# Altium schematic sheet AUDIO.SchDoc: AUDIO
size A4; Date: Not used; ApprovedBy: Not used; CheckedBy: Not used; Author: Not used; CompanyName: STMicroelectronics; DrawnBy: Not used; Engineer: Not used; Organization: Not used; Address1: Not used; Address2: Not used; Address3: Not used; Address4: Not used; DocumentNumber: Not used; Revision: Not used; SheetNumber: 11; SheetTotal: 16; CurrentTime: Not used; CurrentDate: Not used; Time: Not used; DocumentFullPathAndName: Not used; DocumentName: Not used; ModifiedDate: Not used; ImagePath: Not used; ProjectName: Not used; Application_BuildNumber: Not used
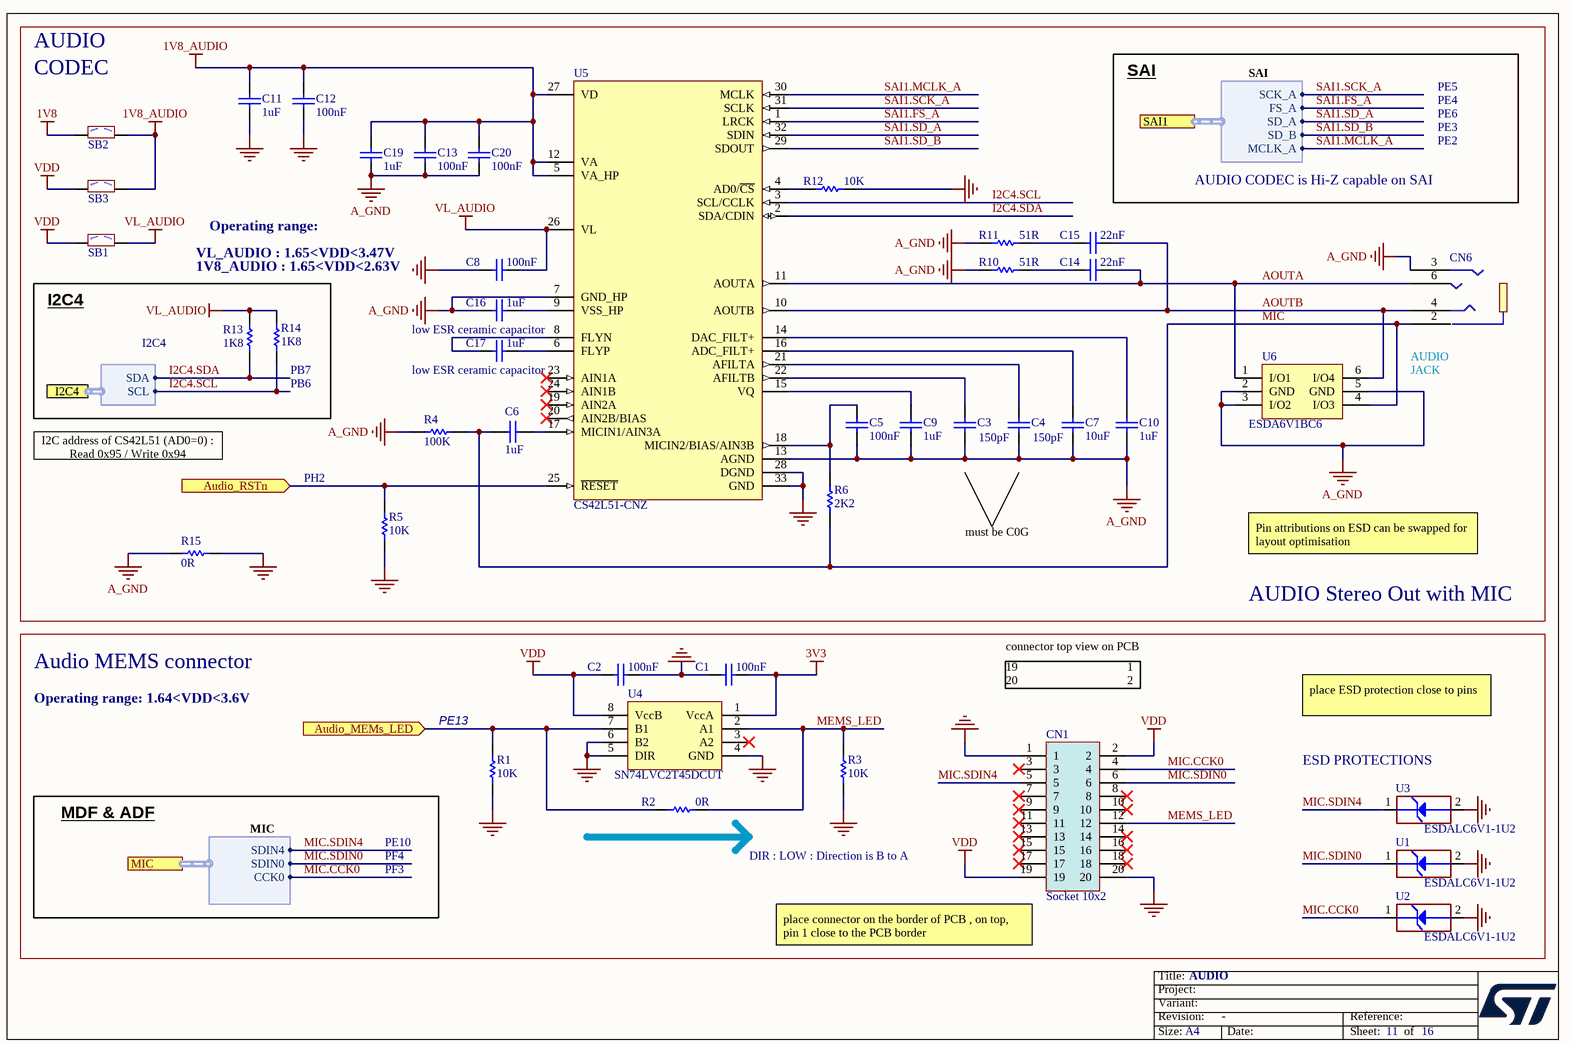
[diagram p0: AUDIO.SchDoc]

## Parts
C1  value 100nF  [C0402]  (hidden comment: Capacitor)
C2  value 100nF  [C0402]  (hidden comment: Capacitor)
C3  value 150pF  [C0603]  (hidden comment: Capacitor)
C4  value 150pF  [C0603]  (hidden comment: Capacitor)
C5  value 100nF  [C0402]  (hidden comment: Capacitor)
C6  value 1uF  [C0402]  (hidden comment: Capacitor)
C7  value 10uF  [C0603]  (hidden comment: Capacitor)
C8  value 100nF  [C0402]  (hidden comment: Capacitor)
C9  value 1uF  [C0402]  (hidden comment: Capacitor)
C10  value 1uF  [C0402]  (hidden comment: Capacitor)
C11  value 1uF  [C0402]  (hidden comment: Capacitor)
C12  value 100nF  [C0402]  (hidden comment: Capacitor)
C13  value 100nF  [C0402]  (hidden comment: Capacitor)
C14  value 22nF  [C0402]  (hidden comment: Capacitor)
C15  value 22nF  [C0402]  (hidden comment: Capacitor)
C16  value 1uF  [C0603]  (hidden comment: Capacitor)
C17  value 1uF  [C0603]  (hidden comment: Capacitor)
C19  value 1uF  [C0402]  (hidden comment: Capacitor)
C20  value 100nF  [C0402]  (hidden comment: Capacitor)
CN1  Socket 10x2  [CON_FCI_20021311-XXX20XXLF]
CN6  Jack_PJ3028B-3_4P  [CON_PHONE-JACK-3P5_HY_PJ3028B]  (value not drawn)
R1  value 10K  [R0402]  (hidden comment: Resistor)
R2  value 0R  [R0402]  (hidden comment: Resistor)
R3  value 10K  [R0402]  (hidden comment: Resistor)
R4  value 100K  [R0402]  (hidden comment: Resistor)
R5  value 10K  [R0402]  (hidden comment: Resistor)
R6  value 2K2  [R0402]  (hidden comment: Resistor)
R10  value 51R  [R0402]  (hidden comment: Resistor)
R11  value 51R  [R0402]  (hidden comment: Resistor)
R12  value 10K  [R0402]  (hidden comment: Resistor)
R13  value 1K8  [R0402]  (hidden comment: Resistor)
R14  value 1K8  [R0402]  (hidden comment: Resistor)
R15  value 0R  [R0402]  (hidden comment: Resistor)
SB1  SB_OFF  [SOLDER-BRIDGE_R0402-0R]  (value not drawn)
SB2  SB_OFF  [SOLDER-BRIDGE_R0402-0R]  (value not drawn)
SB3  SB_OFF  [SOLDER-BRIDGE_R0402-0R]  (value not drawn)
U1  value ESDALC6V1-1U2  [ESD_ST0201]  (hidden comment: ESD-TRANSIL)
U2  value ESDALC6V1-1U2  [ESD_ST0201]  (hidden comment: ESD-TRANSIL)
U3  value ESDALC6V1-1U2  [ESD_ST0201]  (hidden comment: ESD-TRANSIL)
U4  SN74LVC2T45DCUT  [ICC_VSSOP8_DCU_R-PDSO-G8_2X2P30_P050]
U5  CS42L51-CNZ  [ICC_QFN32-EPAD_5X5_P050]
U6  ESDA6V1BC6  [ESD_SOT23-6L]

## Blocks framed on the sheet
I2C4: R13 R14
Audio MEMS connector: C1 C2 CN1 R1-R3 U1-U4

## Ports
Audio_MEMs_LED (in), Audio_RSTn (in), I2C4 (harness I2C4), MIC (harness MIC), SAI1 (harness SAI)

## Harnesses
I2C4: SDA, SCL
MIC: SDIN0, CCK0, SDIN4
SAI: SD_B, FS_A, SD_A, SCK_A, MCLK_A

## Nets
1V8: SB2.1
1V8_AUDIO: C11.2 C12.2 C13.2 C19.2 C20.2 SB2.2 SB3.2 U5.5(VA_HP) U5.12(VA) U5.27(VD)
3V3: C1.2 U4.1(VccA)
A_GND: C3.1 C4.1 C5.1 C7.1 C9.1 C10.1 C13.1 C16.1 C19.1 C20.1 CN6.3 R4.1 R10.1 R11.1 R15.1 U5.7(GND_HP) U5.13(AGND) U6.2(GND) U6.3(I/O2) U6.5(GND)
GND: C1.1 C2.2 C8.2 C11.1 C12.1 CN1.1 CN1.20 R1.1 R3.1 R5.1 R12.2 R15.2 U1.2(GND) U2.2(GND) U3.2(GND) U4.4(GND) U4.5(DIR) U4.6(B2) U5.28(DGND) U5.33(GND)
VDD: C2.1 CN1.2 CN1.19 SB1.1 SB3.1 U4.8(VccB)
VL_AUDIO: C8.1 R13.2 R14.2 SB1.2 U5.26(VL)
AOUTA: C14.2 CN6.6 U5.11(AOUTA) U6.1(I/O1)
AOUTB: C15.2 CN6.4 U5.10(AOUTB) U6.6(I/O4)
Audio_MEMs_LED: R1.2 R2.1 U4.7(B1) ; port Audio_MEMs_LED
Audio_RSTn: R5.2 U5.25(~{RESET}) ; port Audio_RSTn
I2C4.SCL: R14.1 U5.3(SCL/CCLK) ; port I2C4.SCL
I2C4.SDA: R13.1 U5.2(SDA/CDIN) ; port I2C4.SDA
MEMS_LED: CN1.12 R2.2 R3.2 U4.2(A1)
MIC: C6.1 CN6.2 R4.2 R6.1 U6.4(I/O3)
MIC.CCK0: CN1.4 U2.1(IO1) ; port MIC.CCK0
MIC.SDIN0: CN1.6 U1.1(IO1) ; port MIC.SDIN0
MIC.SDIN4: CN1.5 U3.1(IO1) ; port MIC.SDIN4
SAI1.FS_A: U5.1(LRCK) ; port SAI1.FS_A
SAI1.MCLK_A: U5.30(MCLK) ; port SAI1.MCLK_A
SAI1.SCK_A: U5.31(SCLK) ; port SAI1.SCK_A
SAI1.SD_A: U5.32(SDIN) ; port SAI1.SD_A
SAI1.SD_B: U5.29(SDOUT) ; port SAI1.SD_B
NetC3_2: C3.2 U5.22(AFILTB)
NetC4_2: C4.2 U5.21(AFILTA)
NetC5_2: C5.2 R6.2 U5.18(MICIN2/BIAS/AIN3B)
NetC6_2: C6.2 U5.17(MICIN1/AIN3A)
NetC7_2: C7.2 U5.16(ADC_FILT+)
NetC9_2: C9.2 U5.15(VQ)
NetC10_2: C10.2 U5.14(DAC_FILT+)
NetC14_1: C14.1 R10.2
NetC15_1: C15.1 R11.2
NetC16_2: C16.2 U5.9(VSS_HP)
NetC17_1: C17.1 U5.8(FLYN)
NetC17_2: C17.2 U5.6(FLYP)
NetR12_1: R12.1 U5.4(AD0/~{CS})

Not connected (* = marked no-connect by the designer): CN1 3* 7* 8* 9* 10* 11* 13* 14* 15* 16* 17* 18*; U4 3(A2)*; U5 19(AIN2A)* 20(AIN2B/BIAS)* 23(AIN1A)* 24(AIN1B)*

## Notes on the sheet
- AUDIO
- CODEC
- SAI
- PE4
- PE5
- PE6
- AUDIO CODEC is Hi-Z capable on SAI
- PE2
- PE3
- Operating range:
- (near C8) VL_AUDIO : 1.65<VDD<3.47V
- 1V8_AUDIO : 1.65<VDD<2.63V
- PB6
- (near R14) PB7
- low ESR ceramic capacitor
- (near CN6) AUDIO
- JACK
- I2C address of CS42L51 (AD0=0) :
  Read 0x95 / Write 0x94
- PH2
- must be C0G
- Pin attributions on ESD can be swapped for layout optimisation
- connector top view on PCB
- AUDIO Stereo Out with MIC
- Operating range: 1.64<VDD<3.6V
- (near R1) PE13
- 19
- 20
- 1
- 2
- place ESD protection close to pins
- (near U3) ESD PROTECTIONS
- MDF & ADF
- PF4
- PE10
- (near R2) DIR : LOW : Direction is B to A
- PF3
- (near CN1) place connector on the border of PCB , on top, pin 1 close to the PCB border
- Title:
- Project:
- Size:
- Revision:
- Variant:
- A4
- -
- Date:
- Reference:
- Sheet:
- of

## Library data of the parts
C1 C2 C5 C8 C12 C13 C20 = MCD-00006: Capacitor, MLCC, 100nF, 16V, X7R, +/-10%, 0402, T=0.5mm; Manufacturer_Part_Number: CC0402KRX7R7BB104; Manufacturer: YAGEO; Part_Preference: Recommended; Order_Code_RS: 616-9701; Component_Country_Of_Origin: China; Internal_Part_Number: MCD-00006; Status: Released; Part_Type: Capacitor; Package: 0402; ComponentLink1URL: http://tunmcdsvn.tun.st.com/Component_Documentation_Library/Trunk/Capacitor/YAGEO_X7R_Series; Order_Code_Digikey: 311-1338-1-ND; Order_Code_Farnell: 9402047
C3 C4 = MCD-00304: Capacitor, MLCC, 150pF, 50V, COG, +/-5%, 0603, T=0.8mm; Manufacturer_Part_Number: CC0603JRNPO9BN151; Manufacturer: YAGEO; BMS_Part_Number: 9142051; Part_Preference: Recommended; Component_Country_Of_Origin: China; Internal_Part_Number: MCD-00304; Status: Released; Part_Type: Capacitor; Package: 0603; ComponentLink1URL: http://tunmcdsvn.tun.st.com/Component_Documentation_Library/Trunk/Capacitor/YAGEO_NP0_Series; Order_Code_Digikey: 311-1071-1-ND; Order_Code_Farnell: 722108; Order_Code_RS: N/A
C6 C9-C11 C19 = MCD-01722: Capacitor, MLCC, 1uF, 10V, X5R, +/-10%, 0402, T=0.5mm; Manufacturer_Part_Number: CC0402KRX5R6BB105; Manufacturer: YAGEO; Part_Preference: Recommended; Component_Country_Of_Origin: China; Internal_Part_Number: MCD-01722; Status: Released; Part_Type: Capacitor; Package: 0402; ComponentLink1URL: http://tunmcdsvn.tun.st.com/Component_Documentation_Library/Trunk/Capacitor/YAGEO_X5R_Series; Order_Code_Digikey: 311-1439-1-ND; Order_Code_Farnell: 1458896; Order_Code_RS: N/A
C7 = MCD-00243: Capacitor, MLCC, 10uF, 6V3, X5R, +/-10%, 0603, T=0.8mm; Manufacturer_Part_Number: CC0603KRX5R5BB106; Manufacturer: YAGEO; Part_Preference: Recommended; Component_Country_Of_Origin: China; Internal_Part_Number: MCD-00243; Status: Released; Part_Type: Capacitor; Package: 0603; ComponentLink1URL: http://tunmcdsvn.tun.st.com/Component_Documentation_Library/Trunk/Capacitor/YAGEO_X5R_Series; Order_Code_Digikey: 311-1781-1-ND; Order_Code_Farnell: N/A; Order_Code_RS: N/A
C14 C15 = MCD-00202: Capacitor, MLCC, 22nF, 16V, X7R, +/-10%, 0402, T=0.5mm; Manufacturer_Part_Number: CC0402KRX7R7BB223; Manufacturer: YAGEO; Part_Preference: Recommended; Component_Country_Of_Origin: China; Internal_Part_Number: MCD-00202; Status: Released; Part_Type: Capacitor; Package: 0402; ComponentLink1URL: http://tunmcdsvn.tun.st.com/Component_Documentation_Library/Trunk/Capacitor/YAGEO_X7R_Series; Order_Code_Digikey: 311-1378-1-ND; Order_Code_Farnell: 3019299; Order_Code_RS: N/A
C16 C17 = MCD-00010: Capacitor, MLCC, 1uF, 16V, X5R, +/-10%, 0603, T=0.8mm; Manufacturer_Part_Number: CC0603KRX5R7BB105; Manufacturer: YAGEO; Part_Preference: Recommended; Component_Country_Of_Origin: China; Internal_Part_Number: MCD-00010; Status: Released; Part_Type: Capacitor; Package: 0603; ComponentLink1URL: http://tunmcdsvn.tun.st.com/Component_Documentation_Library/Trunk/Capacitor/YAGEO_X5R_Series; Order_Code_Digikey: 311-1444-1-ND; Order_Code_Farnell: 2370680; Order_Code_RS: N/A
CN1 = MCD-00147: Socket, 10x2, 1.27mm, VR, TH, T=4.30mm/2.40mm; Part_Type: Connector; Part_Preference: Recommended; Manufacturer: AMPHENOL ICC; Manufacturer_Part_Number: 20021311-00020T4LF; Order_Code_RS: 170-8859; Component_Country_Of_Origin: China; Internal_Part_Number: MCD-00147; Value: Socket 10x2; Status: Released; ComponentLink1URL: http://tunmcdsvn.tun.st.com/Component_Documentation_Library/Trunk/Connector/AMPHENOL_ICC_20021311_Series/; Order_Code_Digikey: 609-3759-ND; Order_Code_Farnell: 1865317
CN6 = MCD-00263: Jack_ Socket-Stereo, 3.5mm, 4 pins, RA, SMD, T=5mm; Part_Type: Connector; Manufacturer: QIAOD; Part_Preference: Recommended; Value: Jack_ Socket-Stereo_PJ3028B-3_4P; Component_Country_Of_Origin: Unknown; Internal_Part_Number: MCD-00263; Status: Released; Manufacturer_Part_Number: PJ3028B-3_4P; ComponentLink1URL: http://tunmcdsvn.tun.st.com/Component_Documentation_Library/Trunk/Connector/QIAOD_PJ3028B-3_4P/; Order_Code_Digikey: N/A; Order_Code_Farnell: N/A; Order_Code_RS: N/A
R1 R3 R5 R12 = MCD-00053: Resistor, 10K, 0402, +/-1%, 1/16W; Manufacturer_Part_Number: RC0402FR-0710KL; Manufacturer: YAGEO; BMS_Part_Number: 9131590; Part_Preference: Recommended; Component_Country_Of_Origin: China; Internal_Part_Number: MCD-00053; Status: Released; Part_Type: Resistor; ComponentLink1URL: http://tunmcdsvn.tun.st.com/Component_Documentation_Library/Trunk/Resistor/YAGEO_RC_L_Series; Package: 0402; Order_Code_Digikey: 311-10.0KLRCT-ND; Order_Code_Farnell: 9239359; Order_Code_RS: N/A
R2 R15 = MCD-00052: Resistor, 0R, 0402, +/-5%, 1/16W; Manufacturer_Part_Number: RC0402JR-070RL; Manufacturer: YAGEO; Part_Preference: Recommended; Order_Code_RS: 618-5804; Component_Country_Of_Origin: China; Internal_Part_Number: MCD-00052; Status: Released; Part_Type: Resistor; Package: 0402; ComponentLink1URL: http://tunmcdsvn.tun.st.com/Component_Documentation_Library/Trunk/Resistor/YAGEO_RC_L_Series; Order_Code_Digikey: 311-0.0JRCT-ND; Order_Code_Farnell: 9232516RL
R4 = MCD-00059: Resistor, 100K, 0402, +/-1%, 1/16W; Manufacturer_Part_Number: RC0402FR-07100KL; Manufacturer: YAGEO; Part_Preference: Recommended; Component_Country_Of_Origin: China; ShowFields: YES; ID: 2533; Internal_Part_Number: MCD-00059; Status: Released; Part_Type: Resistor; ComponentLink1URL: http://tunmcdsvn.tun.st.com/Component_Documentation_Library/Trunk/Resistor/YAGEO_RC_L_Series; Package: 0402; Order_Code_Digikey: 311-100KLRTR-ND; Order_Code_Farnell: 2421891; Order_Code_RS: N/A
R6 = MCD-00057: Resistor, 2K2, 0402, +/-1%, 1/16W; Manufacturer_Part_Number: RC0402FR-072K2L; Manufacturer: YAGEO; Part_Preference: Recommended; Component_Country_Of_Origin: China; Internal_Part_Number: MCD-00057; Status: Released; Part_Type: Resistor; ComponentLink1URL: http://tunmcdsvn.tun.st.com/Component_Documentation_Library/Trunk/Resistor/YAGEO_RC_L_Series; Package: 0402; Order_Code_Digikey: 311-2.20KLRCT-ND; Order_Code_Farnell: 9239278; Order_Code_RS: N/A
R10 R11 = MCD-00485: Resistor, 51R, 0402, +/-1%, 1/16W; Manufacturer_Part_Number: RC0402FR-0751RL; Manufacturer: YAGEO; Part_Preference: Recommended; Component_Country_Of_Origin: China; Internal_Part_Number: MCD-00485; Status: Released; Part_Type: Resistor; ComponentLink1URL: http://tunmcdsvn.tun.st.com/Component_Documentation_Library/Trunk/Resistor/YAGEO_RC_L_Series; Package: 0402; Order_Code_Digikey: 311-51.0LRCT-ND; Order_Code_Farnell: 1458803; Order_Code_RS: N/A
R13 R14 = MCD-00409: Resistor, 1K8, 0402, +/-1%, 1/16W; Manufacturer_Part_Number: RC0402FR-071K8L; Manufacturer: YAGEO; Part_Preference: Recommended; Component_Country_Of_Origin: China; Internal_Part_Number: MCD-00409; Status: Released; Part_Type: Resistor; Package: 0402; ComponentLink1URL: http://tunmcdsvn.tun.st.com/Component_Documentation_Library/Trunk/Resistor/YAGEO_RC_L_Series; Order_Code_Digikey: 311-1.80KLRCT-ND; Order_Code_Farnell: 9239260; Order_Code_RS: N/A
SB1 SB2 = MCD-02162: Solder Bridge 0402 OFF; Part_Type: Misc; Manufacturer_Part_Number: RC0402JR-070RL; Manufacturer: YAGEO; Part_Preference: Recommended; Order_Code_RS: 618-5804; Component_Country_Of_Origin: China; ShowFields: YES; ID: 4262; Internal_Part_Number: MCD-02162; Status: Released; Package: SB0402; ComponentLink1URL: http://tunmcdsvn.tun.st.com/Component_Datasheet_Library/Trunk/Resistors/Yageo_Resistor_RC0402-series; Order_Code_Digikey: 311-0.0JRTR-ND; Order_Code_Farnell: 2363467
SB3 = MCD-02162: Solder Bridge 0402 OFF; Part_Type: Misc; Manufacturer_Part_Number: RC0402JR-070RL; Manufacturer: YAGEO; Part_Preference: Recommended; Order_Code_RS: 618-5804; Component_Country_Of_Origin: China; Internal_Part_Number: MCD-02162; Status: Checked; Package: SB0402; ComponentLink1URL: http://tunmcdsvn.tun.st.com/Component_Datasheet_Library/Trunk/Resistors/Yageo_Resistor_RC0402-series; Order_Code_Digikey: 311-0.0JRTR-ND; Order_Code_Farnell: 2363467
U1-U3 = MCD-00170: ESD protection 6V1; Part_Type: Diode; Manufacturer: STMICROELECTRONICS; BMS_Part_Number: 9151132; Part_Preference: Recommended; Manufacturer_HQ_COO: EU; Component_Country_Of_Origin: China; Internal_Part_Number: MCD-00170; Status: Released; Manufacturer_Part_Number: ESDALC6V1-1U2; ComponentLink1URL: http://tunmcdsvn.tun.st.com/Component_Datasheet_Library/Trunk/Diodes/STM_ESD_ESDALC6V1-1U2
U4 = MCD-00264: Dual bit dual supply bus transceiver; Part_Type: IC; Manufacturer: TEXAS INSTRUMENTS; BMS_Part_Number: 9169311; Part_Preference: Recommended; Component_Country_Of_Origin: Thailand; Internal_Part_Number: MCD-00264; Value: SN74LVC2T45DCUT; Status: Released; Manufacturer_Part_Number: SN74LVC2T45DCUT; ComponentLink1URL: http://tunmcdsvn.tun.st.com/Component_Datasheet_Library/Trunk/IC/TI_Dual_bit_tranceiver_SN74LVC2T45
U5 = MCD-00265: Low-Power, Stereo Codec with Headphone Amp; Manufacturer: CIRRUS LOGIC; Part_Type: IC; Part_Preference: Recommended; Component_Country_Of_Origin: China; Internal_Part_Number: MCD-00265; Value: CS42L51-CNZ; Manufacturer_Part_Number: CS42L51-CNZ; ComponentLink1URL: http://tunmcdsvn.tun.st.com/Component_Datasheet_Library/Trunk/IC/Cirrus Logic_CS42L51; Status: Released
U6 = MCD-00247: Quad Bidir ESD protection; Manufacturer: STMICROELECTRONICS; Part_Type: Diode; BMS_Part_Number: 9179038; Part_Preference: Recommended; Manufacturer_HQ_COO: EU; Component_Country_Of_Origin: China; Value: ESDA6V1BC6; Internal_Part_Number: MCD-00247; Manufacturer_Part_Number: ESDA6V1BC6; Status: Released; ComponentLink1URL: http://tunmcdsvn.tun.st.com/Component_Datasheet_Library/Trunk/Diodes/STM_ESD_ESDA6V1BC6